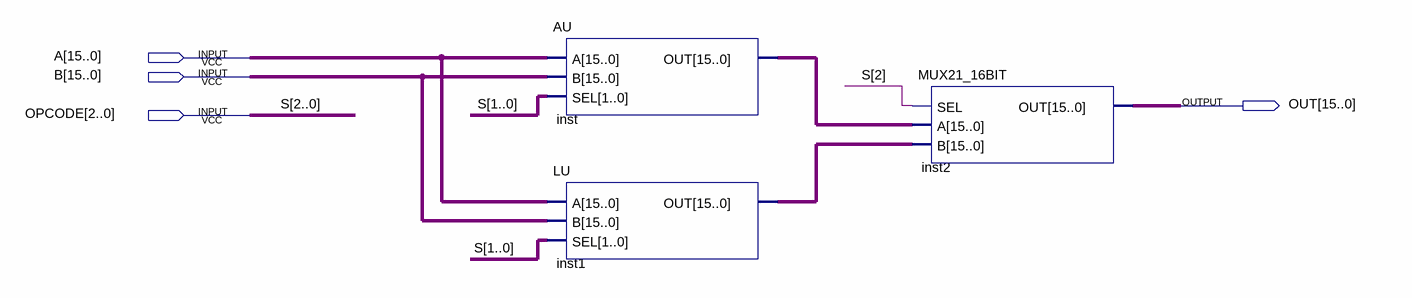
[diagram p0: schematic sheet]
// Quartus schematic ALU.bdf as structural Verilog: 3 symbols, 4 pins
module ALU (
  input  [15:0] A,
  input  [15:0] B,
  input  [2:0] OPCODE,
  output [15:0] OUT
);

  wire [15:0] inst1_out, inst_out;

  AU inst (.A(A), .B(B), .SEL(OPCODE[1:0]), .OUT(inst_out));
  LU inst1 (.A(A), .B(B), .SEL(OPCODE[1:0]), .OUT(inst1_out));
  MUX21_16BIT inst2 (.SEL(OPCODE[2]), .A(inst_out), .B(inst1_out), .OUT(OUT));

  // Other names for the same wires on the sheet: S[2:0] = OPCODE
endmodule
